# Altium project L-ink.PrjPCB
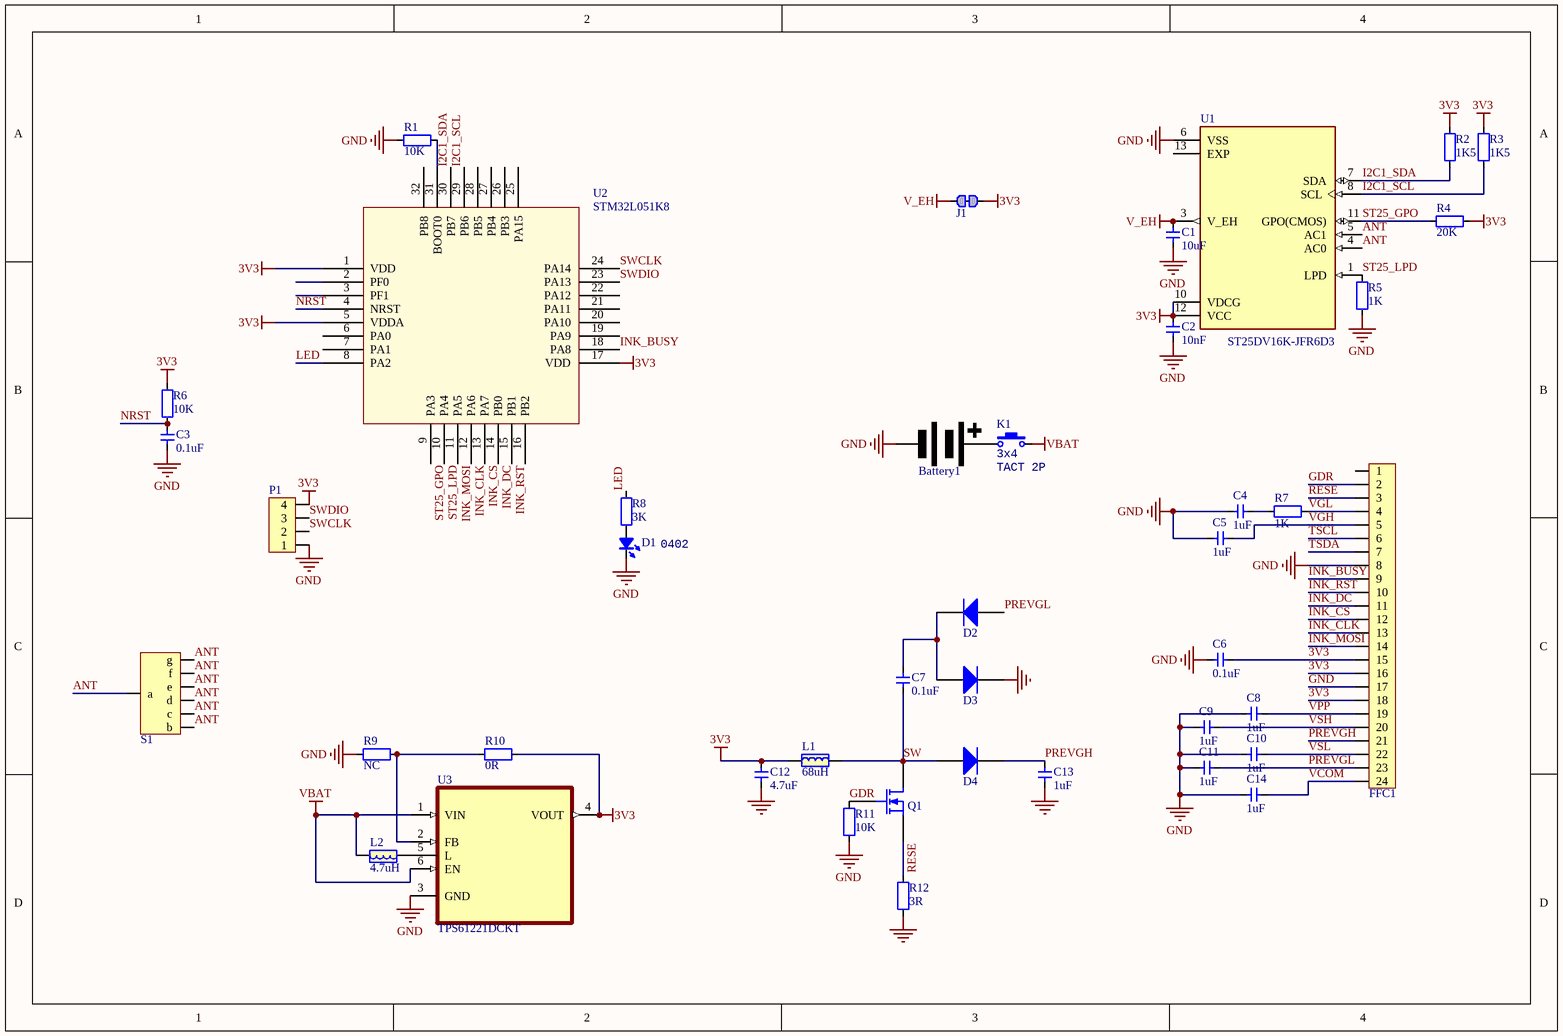
[diagram p0: L-ink.SchDoc]
1 sheet, 42 parts. Net scope: global (net labels, ports and power ports of the same name join across sheets).
Board file: L-ink.PcbDoc

## Sheet L-ink.SchDoc
size A4

### Parts
Battery1  Battery  [CR2032-1]  (value not drawn)
C1  10uF  [CAP_0402]
C2  10nF  [CAP_0402]
C3  0.1uF  [CAP_0402]
C4  1uF  [CAP_0402]
C5  1uF  [CAP_0402]
C6  0.1uF  [CAP_0402]
C7  0.1uF  [CAP_0402]
C8  1uF  [CAP_0402]
C9  1uF  [CAP_0402]
C10  1uF  [CAP_0402]
C11  1uF  [CAP_0402]
C12  4.7uF  [0603-CAP]
C13  1uF  [CAP_0402]
C14  1uF  [CAP_0402]
D1  Type: 0402  [LED_0402_BLUE]  (hidden comment: color?)
D2  二极管-5819W  [SOD-123]  (value not drawn)
D3  二极管-5819W  [SOD-123]  (value not drawn)
D4  二极管-5819W  [SOD-123]  (value not drawn)
FFC1  FFC_0.5_24  [FFC_0.5_24_INK]  (value not drawn)
J1  跳线  [0402-0R]  (value not drawn)
K1  value 3x4  [ButtonTACT_3x4x2_180H]  (hidden comment: TACT 2P)
L1  68uH  [2520-L]
L2  4.7uH  [0805-L]
P1  HDR1x4_2.0  [HDR 4_2]  (value not drawn)
Q1  MOSFET-N  [SOT23-3]  (value not drawn)
R1  10K  [RES_0402]
R2  1K5  [RES_0402]
R3  1K5  [RES_0402]
R4  20K  [RES_0402]
R5  1K  [RES_0402]
R6  10K  [RES_0402]
R7  1K  [RES_0402]
R8  3K  [RES_0402]
R9  NC  [RES_0402]
R10  0R  [RES_0402]
R11  10K  [RES_0402]
R12  3R  [RES_0402]
S1  WHEEL_SWITCH  [WHEEL_SWITCH]  (value not drawn)
U1  ST25DV16K-JFR6D3  [PSON50P-302X302X60-13N]
U2  STM32L051K8  [QFN-32]
U3  TPS61221DCKT  [SOT65P210X110-6N]

### Nets
3V3: C2.1 C6.2 C12.1 FFC1.15 FFC1.16 FFC1.18 J1.2 L1.1 P1.4 R2.1 R3.1 R4.1 R6.2 R10.1 U1.10(VDCG) U1.12(VCC) U2.1(VDD) U2.5(VDDA) U2.17(VDD) U3.4(VOUT)
GND: Battery1.1(-) C1.2 C2.2 C3.2 C4.1 C5.1 C6.1 C8.1 C9.1 C10.1 C11.1 C12.2 C13.2 C14.1 D1.2(K) D3.2(K) FFC1.8 FFC1.17 P1.1 R1.2 R5.2 R9.2 R11.1 R12.1 U1.6(VSS) U3.3(GND)
V_EH: C1.1 J1.1 U1.3(V_EH)
VBAT: K1.2 L2.2 U3.1(VIN) U3.6(EN)
ANT: S1.a S1.b S1.c S1.d S1.e S1.f S1.g U1.4(AC0) U1.5(AC1)
GDR: FFC1.2 Q1.1(G) R11.2
I2C1_SCL: R3.2 U1.8(SCL) U2.29(PB6)
I2C1_SDA: R2.2 U1.7(SDA) U2.30(PB7)
INK_BUSY: FFC1.9 U2.18(PA8)
INK_CLK: FFC1.13 U2.12(PA6)
INK_CS: FFC1.12 U2.13(PA7)
INK_DC: FFC1.11 U2.14(PB0)
INK_MOSI: FFC1.14 U2.11(PA5)
INK_RST: FFC1.10 U2.15(PB1)
LED: R8.2 U2.8(PA2)
NRST: C3.1 R6.1 U2.4(NRST)
PREVGH: C13.1 D4.2(K) FFC1.21
PREVGL: C11.2 D2.1(A) FFC1.23
RESE: FFC1.3 Q1.2(S) R12.2
ST25_GPO: R4.2 U1.11(GPO(CMOS)) U2.9(PA3)
ST25_LPD: R5.1 U1.1(LPD) U2.10(PA4)
SW: C7.2 D4.1(A) L1.2 Q1.3(D)
SWCLK: P1.2 U2.24(PA14)
SWDIO: P1.3 U2.23(PA13)
TSCL: FFC1.6
TSDA: FFC1.7
VCOM: C14.2 FFC1.24
VGH: C5.2 FFC1.5
VGL: FFC1.4 R7.1
VPP: C8.2 FFC1.19
VSH: C9.2 FFC1.20
VSL: C10.2 FFC1.22
NetBattery1_2: Battery1.2(+) K1.1
NetC4_2: C4.2 R7.2
NetC7_1: C7.1 D2.2(K) D3.1(A)
NetD1_1: D1.1(A) R8.1
NetL2_1: L2.1 U3.5(L)
NetR1_1: R1.1 U2.31(BOOT0)
NetR9_1: R9.1 R10.2 U3.2(FB)

Not connected (* = marked no-connect by the designer): FFC1 1; U1 13(EXP); U2 2(PF0) 3(PF1) 6(PA0) 7(PA1) 16(PB2) 19(PA9) 20(PA10) 21(PA11) 22(PA12) 25(PA15) 26(PB3) 27(PB4) 28(PB5) 32(PB8)

### Library data of the parts
C1-C11 C13 C14 = 电容-0402: Capacitor; Value: 0.1u
C12 = 电容-0603: Capacitor; Value: 0.1u
D1 = LED_0402: LED; Value: color?
D2-D4 = 二极管-5819W: 40V
FFC1 = FFC_0.5_24_INK: FFC
J1 = 跳线: Resistor; Published: 8-Jun-2000; LatestRevisionDate: 17-Jul-2002; LatestRevisionNote: Re-released for DXP Platform.; PackageReference: AXIAL-0.4; Publisher: Altium Limited; PackageDescription: Axial Device, Thru-Hole; 2 Leads; 0.4 in Pin Spacing
K1 = ButtonTACT_3x4x2_180: Button; type: TACT 2P
L1 = 电感-2520: 磁珠
L2 = 电感-0805: 磁珠
Q1 = MOSFET-N: N-Channel MOSFET; Published: 8-Jun-2000; LatestRevisionDate: 17-Jul-2002; LatestRevisionNote: Re-released for DXP Platform.; PackageVersion: 1995/1996; PackageReference: E3; Publisher: Altium Limited; PackageDescription: TO, Flat Index; 3 In-Line, Axial Leads; Body Dia. 4.6mm; Lead Dia. 0.5 mm (max)
R1-R12 = 电阻-0402: Resistor; Value: 22R
S1 = WHEEL_SWITCH: LDO
U1 = ST25DV16K-JFR6D3: RFID Transponder IC 13.56MHz ISO 15693 IÂ²C 1.8V ~ 5.5V 12-UFDFN Exposed Pad; MF: STMicroelectronics; SnapEDA_Link: https://www.snapeda.com/parts/ST25DV16K-JFR6D3/STMicroelectronics/view-part/901342/?ref=snap; Price: None; MP: ST25DV16K-JFR6D3; Package: D2PAK STMicroelectronics; Value: *; Availability: Unavailable
U3 = TPS61221DCKT: Boost Switching Regulator IC Positive Fixed 3.3V 1 Output 200mA _Switch_ 6-TSSOP, SC-88, SOT-363; MF: Texas Instruments; MP: TPS61221DCK; Price: None; SnapEDA_Link: https://www.snapeda.com/parts/TPS61221DCK/Texas%20Instruments/view-part/2767825/?ref=snap; Availability: Unavailable; Value: *; Package: SOT-363 Texas Instruments